# EAGLE schematic E_KEYPAD_2_2 (EAGLE 6.4)
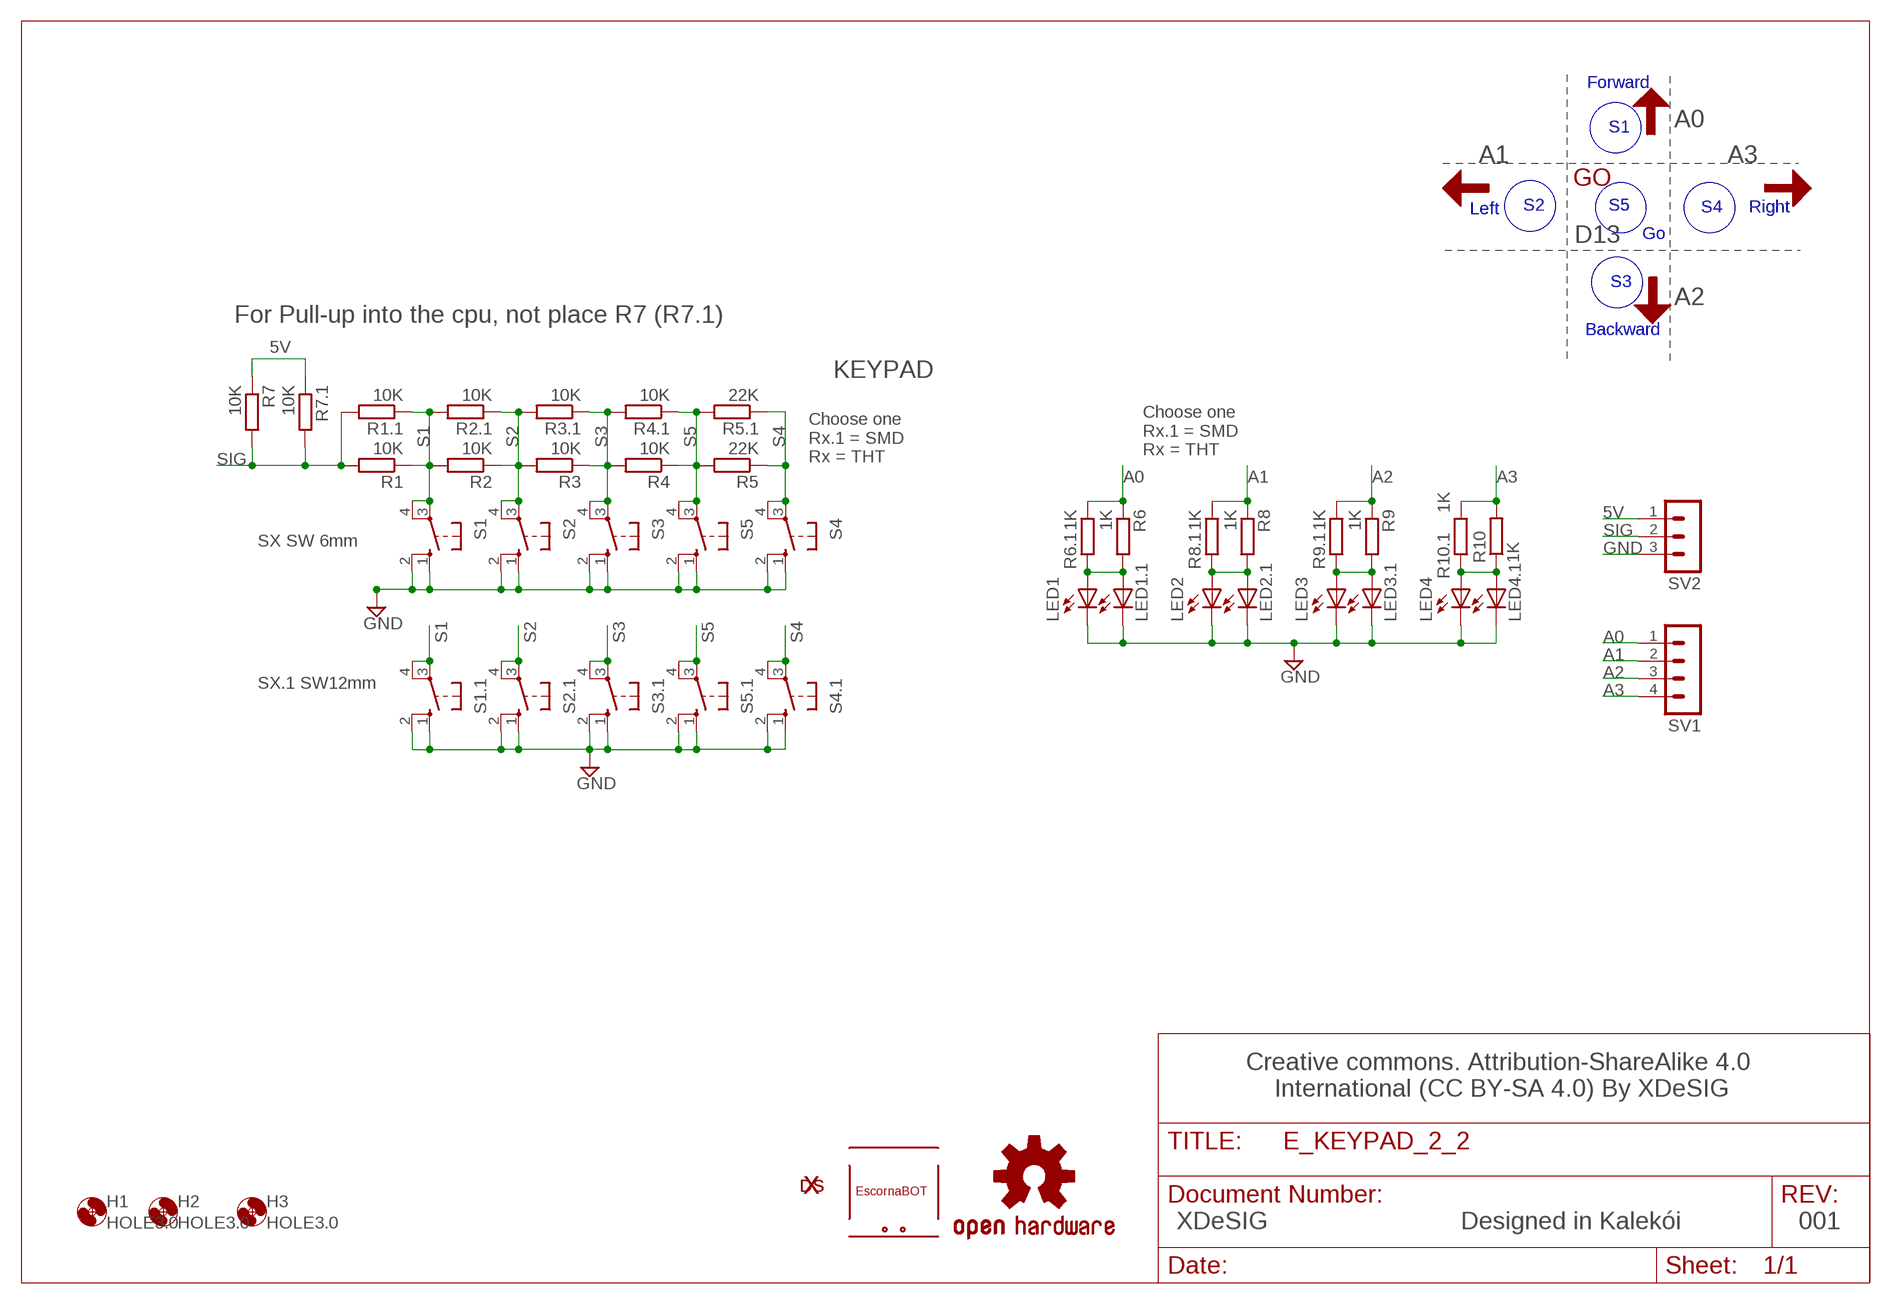
[diagram p0: schematic, sheet 1]

## Parts
H1  HOLE3.0  MOUNT-HOLE3.0  [3,0]
H2  HOLE3.0  MOUNT-HOLE3.0  [3,0]
H3  HOLE3.0  MOUNT-HOLE3.0  [3,0]
LED1  LED3MM  [LED3MM]
LED1.1  LEDCHIPLED_0603  [CHIPLED_0603]
LED2  LED3MM  [LED3MM]
LED2.1  LEDCHIPLED_0603  [CHIPLED_0603]
LED3  LED3MM  [LED3MM]
LED3.1  LEDCHIPLED_0603  [CHIPLED_0603]
LED4  LED3MM  [LED3MM]
LED4.1  LEDCHIPLED_0603  [CHIPLED_0603]
LOGO2  OSHW-LOGOS  [OSHW-LOGO-S]
R1  10K  R-EU_0204/7  [0204/7]
R1.1  10K  R-EU_R0603  [R0603]
R2  10K  R-EU_0204/7  [0204/7]
R2.1  10K  R-EU_R0603  [R0603]
R3  10K  R-EU_0204/7  [0204/7]
R3.1  10K  R-EU_R0603  [R0603]
R4  10K  R-EU_0204/7  [0204/7]
R4.1  10K  R-EU_R0603  [R0603]
R5  22K  R-EU_0204/7  [0204/7]
R5.1  22K  R-EU_R0603  [R0603]
R6  1K  R-EU_0204/7  [0204/7]
R6.1  1K  R-EU_R0603  [R0603]
R7  10K  R-EU_0204/7  [0204/7]
R7.1  10K  R-EU_R0603  [R0603]
R8  1K  R-EU_0204/7  [0204/7]
R8.1  1K  R-EU_R0603  [R0603]
R9  1K  R-EU_0204/7  [0204/7]
R9.1  1K  R-EU_R0603  [R0603]
R10  1K  R-EU_0204/7  [0204/7]
R10.1  1K  R-EU_R0603  [R0603]
S1  10-XX  [B3F-10XX]
S1.1  40-XX  [B3F-40XX]
S2  10-XX  [B3F-10XX]
S2.1  40-XX  [B3F-40XX]
S3  10-XX  [B3F-10XX]
S3.1  40-XX  [B3F-40XX]
S4  10-XX  [B3F-10XX]
S4.1  40-XX  [B3F-40XX]
S5  10-XX  [B3F-10XX]
S5.1  40-XX  [B3F-40XX]
SV1  MA04-1  [MA04-1]
SV2  MA03-1  [MA03-1]
U$1  ESCORNABOT  [ESCORNA_PEQUE]
U$3  FRECHA  [FRECHA]
U$4  FRECHA  [FRECHA]
U$5  GO  [VALE]
U$6  FRECHA  [FRECHA]
U$7  XDESIG21  [XDESIG]
U$10  XDESIG  [XDESIG_CU_2]
U$11  FRECHA  [FRECHA]

## Nets
5V: R7.1 R7.1.1 SV2.1
A0: R6.1 R6.1.1 SV1.1
A1: R8.1 R8.1.1 SV1.2
A2: R9.1 R9.1.1 SV1.3
A3: R10.1.1 R10.2 SV1.4
GND: LED1.1.C LED1.K(C) LED2.1.C LED2.K(C) LED3.1.C LED3.K(C) LED4.1.C LED4.K(C) S1.1(S) S1.1.1(S) S1.1.2(S1) S1.2(S1) S2.1(S) S2.1.1(S) S2.1.2(S1) S2.2(S1) S3.1(S) S3.1.1(S) S3.1.2(S1) S3.2(S1) S4.1(S) S4.1.1(S) S4.1.2(S1) S4.2(S1) S5.1(S) S5.1.1(S) S5.1.2(S1) S5.2(S1) SV2.3
N$4: LED2.1.A LED2.A R8.1.2 R8.2
N$5: LED1.1.A LED1.A R6.1.2 R6.2
N$6: LED3.1.A LED3.A R9.1.2 R9.2
N$8: LED4.1.A LED4.A R10.1 R10.1.2
S1: R1.1 R1.1.1 R2.1.2 R2.2 S1.1.3(P) S1.1.4(P1) S1.3(P) S1.4(P1)
S2: R2.1 R2.1.1 R3.1.2 R3.2 S2.1.3(P) S2.1.4(P1) S2.3(P) S2.4(P1)
S3: R3.1 R3.1.1 R4.1.2 R4.2 S3.1.3(P) S3.1.4(P1) S3.3(P) S3.4(P1)
S4: R5.1 R5.1.1 S4.1.3(P) S4.1.4(P1) S4.3(P) S4.4(P1)
S5: R4.1 R4.1.1 R5.1.2 R5.2 S5.1.3(P) S5.1.4(P1) S5.3(P) S5.4(P1)
SIG: R1.1.2 R1.2 R7.1.2 R7.2 SV2.2

## Notes on the sheet
- Forward
- A0
- S1
- A1 | A3
- Left | S2 | S5 | S4 | Right
- D13 | Go
- S3
- A2
- For Pull-up into the cpu, not place R7 (R7.1)
- Backward
- KEYPAD
- Choose one
  Rx.1 = SMD
  Rx = THT
- Choose one
  Rx.1 = SMD
  Rx = THT
- SX SW 6mm
- SX.1 SW12mm
- Creative commons. Attribution-ShareAlike 4.0
   International (CC BY-SA 4.0) By XDeSIG
- XDeSIG | Designed in Kalekói | 001

## Library data of the parts
H1-H3 = holes:MOUNT-HOLE: MOUNTING HOLE with drill center marker
LED1 LED1.1 LED2 LED2.1 LED3 LED3.1 LED4 LED4.1 = adafruit:LED: LED OSRAM: - CHIPLED LG R971, LG N971, LY N971, LG Q971, LY Q971, LO R971, LY R971 LH N974, LH R974 LS Q976, LO Q976, LY Q976 LO Q996 - Hyper CHIPLED LW Q18S LB Q993, LB Q99A, LB R99A - SideLED LS A670, LO A670, LY A670, LG A670, LP A670 LB A673, LV A673, LT A673, LW A673 LH A674 LY A675 LS A676, LA A676, LO A676, LY A676, LW A676 LS A679, LY A679, LG A679 - Hyper Micro SIDELED® LS Y876, LA Y876, LO Y876, LY Y876 LT Y87S - SmartLED LW L88C, LW L88S LB L89C, LB L89S, LG L890 LS L89K, LO L89K, LY L89K LS L896, LA L896, LO L896, LY L896 - TOPLED LS T670, LO T670, LY T670, LG T670, LP T670 LSG T670, LSP T670, LSY T670, LOP T670, LYG T670 LG T671, LOG T671, LSG T671 LB T673, LV T673, LT T673, LW T673 LH T674 LS T676, LA T676, LO T676, LY T676, LB T676, LH T676, LSB T676, LW T676 LB T67C, LV T67C, LT T67C, LS T67K, LO T67K, LY T67K, LW E67C LS E67B, LA E67B, LO E67B, LY E67B, LB E67C, LV E67C, LT E67C LW T67C LS T679, LY T679, LG T679 LS T770, LO T770, LY T770, LG T770, LP T770 LB T773, LV T773, LT T773, LW T773 LH T774 LS E675, LA E675, LY E675, LS T675 LS T776, LA T776, LO T776, LY T776, LB T776 LHGB T686 LT T68C, LB T68C - Hyper Mini TOPLED® LB M676 - Mini TOPLED Santana® LG M470 LS M47K, LO M47K, LY M47K Source: http://www.osram.convergy.de/
LOGO2 = SparkFun-Aesthetics:OSHW-LOGO: Open Source Hardware Logo This logo indicates the piece of hardware it is found on incorporates a OSHW license and/or adheres to the definition of open source hardware found here: http://freedomdefined.org/OSHW
R1 R1.1 R2 R2.1 R3 R3.1 R4 R4.1 R5 R5.1 R6 R6.1 R7 R7.1 R8 R8.1 R9 R9.1 R10 R10.1 = rcl:R-EU_: RESISTOR, European symbol
S1-S5 = switch-omron:10-XX: OMRON SWITCH; MPN: B3F-1000; OC_FARNELL: 176432; OC_NEWARK: 36M3542
S1.1 S2.1 S3.1 S4.1 S5.1 = switch-omron:40-XX: OMRON SWITCH; MF: OMRON COMPONENTS USA; MPN: B3F-4000; OC_FARNELL: 176434; OC_NEWARK: 36K3105
SV1 = con-lstb:MA04-1: PIN HEADER; OC_FARNELL: unknown; OC_NEWARK: unknown
SV2 = con-lstb:MA03-1: PIN HEADER; OC_FARNELL: unknown; OC_NEWARK: unknown
U$1 = escorna:ESCORNABOT
U$3 U$4 U$6 U$11 = escorna:FRECHA
U$5 = escorna:GO
U$7 U$10 = xdesig:XDESIG

## Net classes
0 default: width 0.254 mm, drill 0.61 mm, clearance 0.254 mm